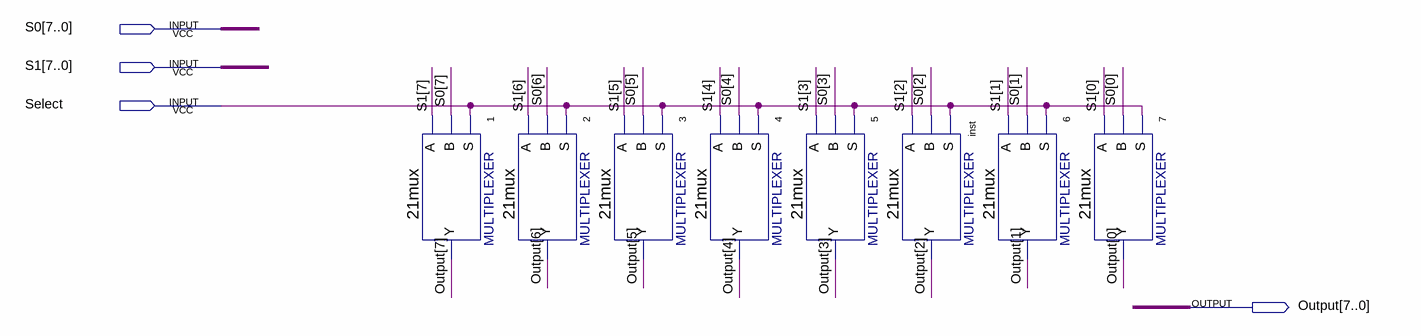
[diagram p0: schematic sheet]
// Quartus schematic mux21_8bits.bdf as structural Verilog: 8 symbols, 4 pins
module mux21_8bits (
  input  [7:0] S0,
  input  [7:0] S1,
  input  Select,
  output [7:0] Output
);

  \21mux  u_1 (.S(Select), .B(S0[7]), .A(S1[7]), .Y(Output[7]));
  \21mux  u_2 (.S(Select), .B(S0[6]), .A(S1[6]), .Y(Output[6]));
  \21mux  u_3 (.S(Select), .B(S0[5]), .A(S1[5]), .Y(Output[5]));
  \21mux  u_4 (.S(Select), .B(S0[4]), .A(S1[4]), .Y(Output[4]));
  \21mux  u_5 (.S(Select), .B(S0[3]), .A(S1[3]), .Y(Output[3]));
  \21mux  inst (.S(Select), .B(S0[2]), .A(S1[2]), .Y(Output[2]));
  \21mux  u_6 (.S(Select), .B(S0[1]), .A(S1[1]), .Y(Output[1]));
  \21mux  u_7 (.S(Select), .B(S0[0]), .A(S1[0]), .Y(Output[0]));
endmodule
